# EAGLE design main_ver1.41 (EAGLE 7.2.0)
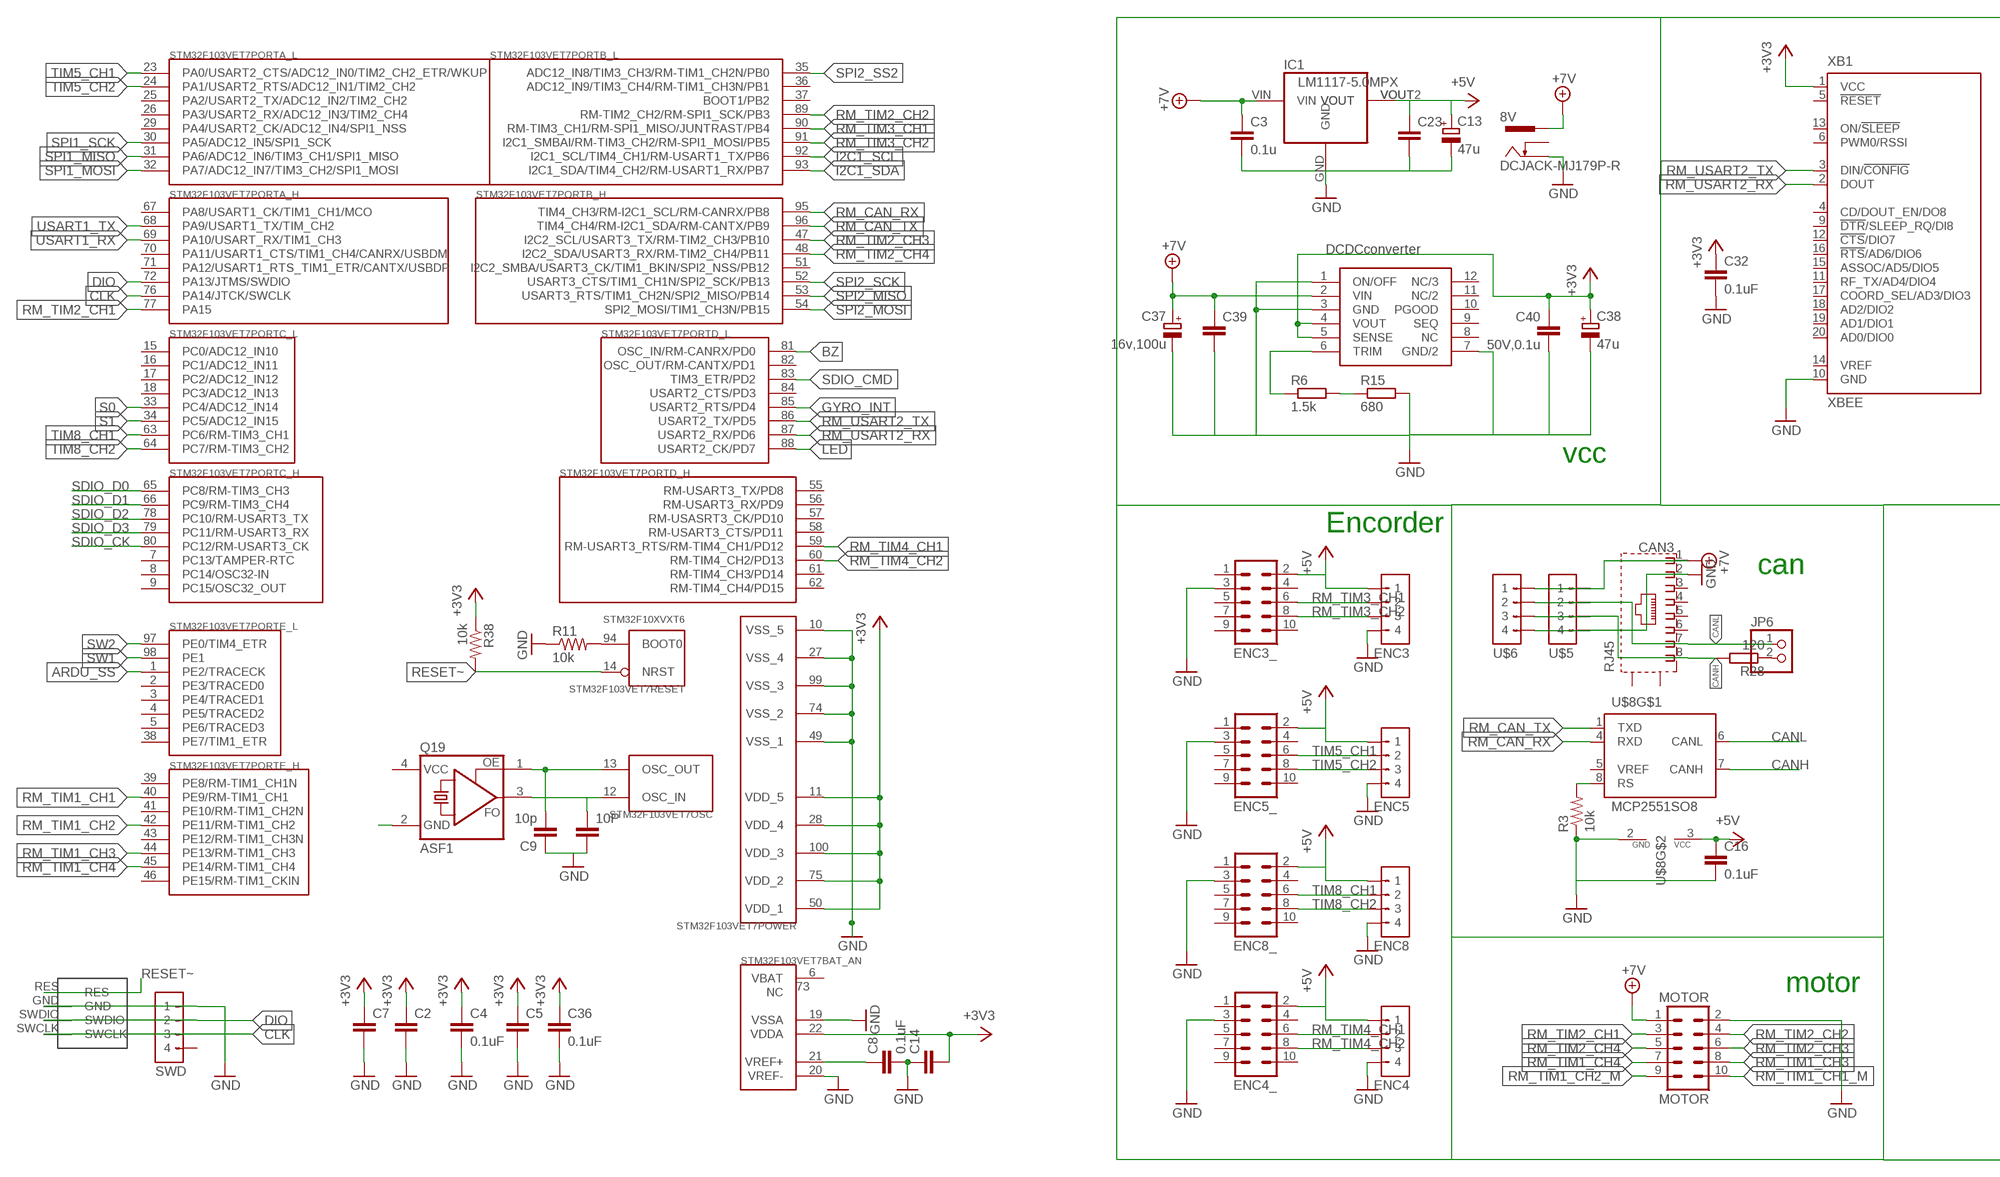
[diagram p0: schematic, sheet 1, part 1 of 2]
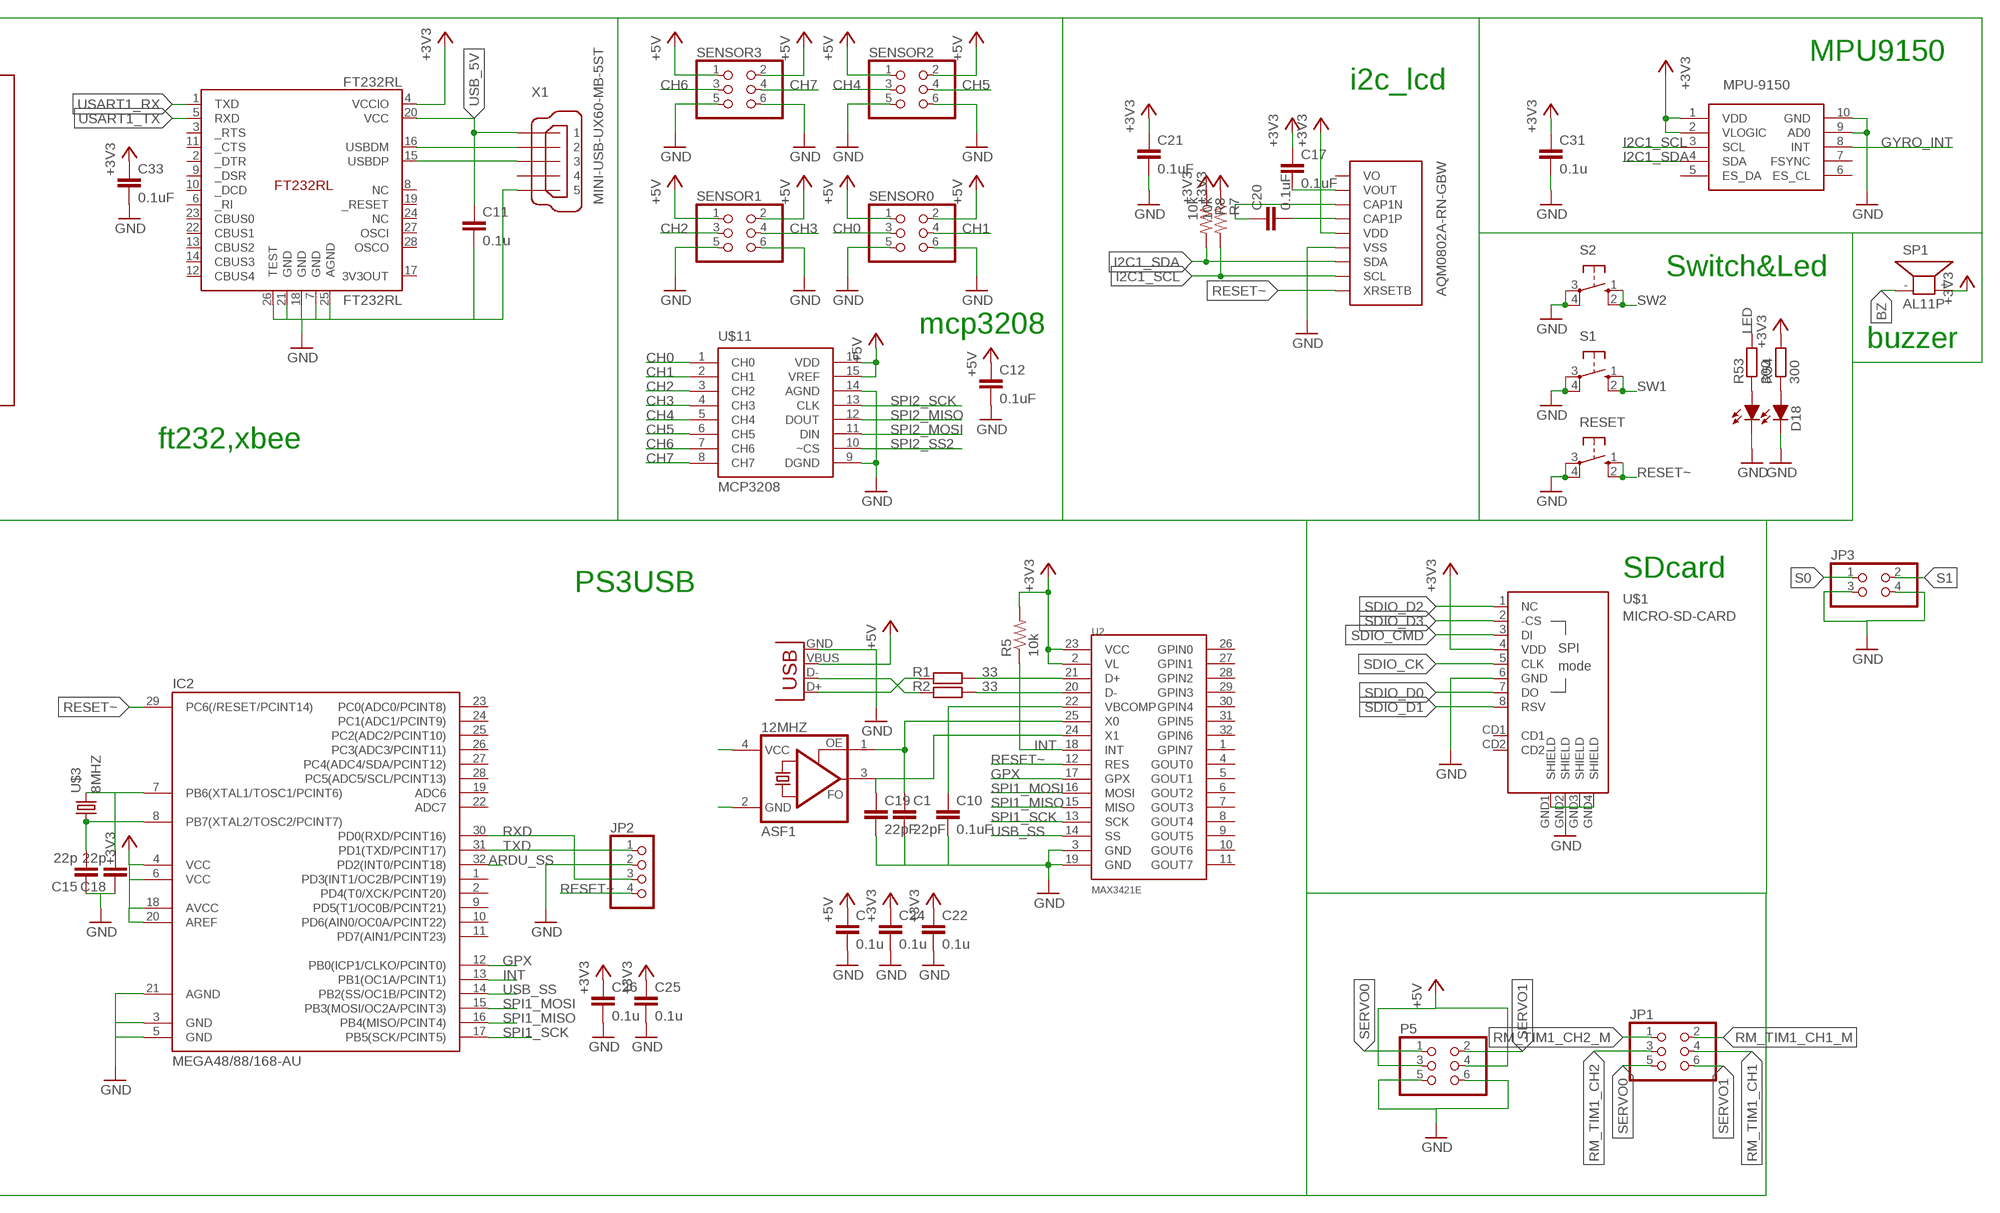
[diagram p1: schematic, sheet 1, part 2 of 2]

## Parts
8V  DCJACK-MJ179P-R  [MJ-179P-R]
10P  C-EUC0603  [C0603]
12MHZ  ASF1  [ASF]
AQM0802A-RN-GBW  AQM0802A-RN-GBW  [AQM0802]
C  0.1u  C-EUC0603  [C0603]
C1  22pF  C-EUC0603K  [C0603K]
C2  C-EUC0603  [C0603]
C3  0.1u  C-EUC0603K  [C0603K]
C4  0.1uF  C-EUC0603  [C0603]
C5  C-EUC0603  [C0603]
C7  C-EUC0603  [C0603]
C8  0.1uF  C-EUC0603  [C0603]
C9  10p  C-EUC0603  [C0603]
C10  0.1uF  C-EUC0603K  [C0603K]
C11  0.1u  C-EUC0603K  [C0603K]
C12  0.1uF  C-EUC0603  [C0603]
C13  47u  CPOL-EU153CLV-0405  [153CLV-0405]
C14  C-EUC0603  [C0603]
C15  22p  C-EUC0603K  [C0603K]
C16  0.1uF  C-EUC0603  [C0603]
C17  0.1uF  C-EUC0603  [C0603]
C18  22p  C-EUC0603K  [C0603K]
C19  22pF  C-EUC0603K  [C0603K]
C20  0.1uF  C-EUC0603  [C0603]
C21  0.1uF  C-EUC0603  [C0603]
C22  0.1u  C-EUC0603  [C0603]
C23  C-EUC0603K  [C0603K]
C24  0.1u  C-EUC0603  [C0603]
C25  0.1u  C-EUC0603  [C0603]
C26  0.1u  C-EUC0603  [C0603]
C31  0.1u  C-EUC0603K  [C0603K]
C32  0.1uF  C-EUC0603  [C0603]
C33  0.1uF  C-EUC0603  [C0603]
C36  0.1uF  C-EUC0603  [C0603]
C37  16v,100u  CPOL-EU153CLV-0605  [153CLV-0605]
C38  47u  CPOL-EU153CLV-0405  [153CLV-0405]
C39  C-EUC0603K  [C0603K]
C40  50V,0.1u  C-EUC0603K  [C0603K]
CAN3  RJ45  [LAN]
D18  SEC2XX4  [LED3025]
ENC3  CN4-JST-XH-TOP  [JST-B4B-XH-A]
ENC3_  ML10L  [ML10L]
ENC4  CN4-JST-XH-TOP  [JST-B4B-XH-A]
ENC4_  ML10L  [ML10L]
ENC5  CN4-JST-XH-TOP  [JST-B4B-XH-A]
ENC5_  ML10L  [ML10L]
ENC8  CN4-JST-XH-TOP  [JST-B4B-XH-A]
ENC8_  ML10L  [ML10L]
FT232RL  FT232RL  [SSOP-28]
IC1  LM1117-5.0MPX  LM1117-5.0IMP  [SOT223]
IC2  MEGA48/88/168-AU  [TQFP32-08]
JP1  PINHD-2X3  [2X03]
JP2  PINHD-1X4  [1X04]
JP3  PINHD-2X2/90  [2X02/90]
JP6  PINHD-1X2  [1X02]
MOTOR  MOTOR  ML10L  [ML10L]
MPU9150  MPU-9150  [MPU-9150]
P5  PINHD-2X3/90  [2X03/90]
Q19  ASF1  [ASF]
R1  33  R-EU_R0603  [R0603]
R2  33  R-EU_R0603  [R0603]
R3  10k  R-US_R0603  [R0603]
R5  10k  R-US_R0603  [R0603]
R6  1.5k  R-EU_R0603  [R0603]
R7  10k  R-US_R0603  [R0603]
R8  10k  R-US_R0603  [R0603]
R11  10k  R-US_R0603  [R0603]
R15  680  R-EU_R0603  [R0603]
R28  120  R-EU_R0603  [R0603]
R38  10k  R-US_R0603  [R0603]
R53  300  R-EU_R0603  [R0603]
R54  300  R-EU_R0603  [R0603]
RESET  10-XX  [B3F-10XX]
S1  10-XX  [B3F-10XX]
S2  10-XX  [B3F-10XX]
SENSOR0  PINHD-2X3/90  [2X03/90]
SENSOR1  PINHD-2X3/90  [2X03/90]
SENSOR2  PINHD-2X3/90  [2X03/90]
SENSOR3  PINHD-2X3/90  [2X03/90]
SP1  AL11P  [AL11P]
STM32F103VET7  STM32F10XVXT6  [LQFP100]
SWD  TOP_TYPE_4PIN  [TOP_TYPE_4PIN]
U2  MAX3421E  MAX3421ESMD  [TQFP32-5MM]
U$1  MICRO-SD-CARD  [DM3AT-SF-PEJ]
U$2  OKL-T/6-W12N  [OKL-T/6-W12]
U$3  8MHZ  [8MHZ_C]
U$5  S4B-XH-SM4-TB  [S4B-XH-SM4-TB]
U$6  S4B-XH-SM4-TB  [S4B-XH-SM4-TB]
U$7  STRINK  [STLINK]
U$8  MCP2551SO8  [SO08]
U$11  MCP3208  [SO16]
X1  MINI-USB-UX60-MB-5ST  [UX60-MB-5ST]
X2  USB_  [USB-A-S-SILK-FEMALE]
XB1  XBEE  [XBEE]

## Nets
+3V3 [VCC]: AQM0802A-RN-GBW.P$5(VDD) C2.1 C4.1 C5.1 C7.1 C14.2 C17.1 C21.1 C22.1 C24.1 C25.1 C26.1 C31.1 C32.1 C33.1 C36.1 C38.+ C40.1 FT232RL.4(VCCIO) IC2.4(VCC) IC2.6(VCC) IC2.18(AVCC) IC2.20(AREF) MPU9150.1(VDD) MPU9150.2(VLOGIC) R5.2 R7.1 R8.1 R38.1 R54.2 SP1.+ STM32F103VET7.11(POWER:VDD_5) STM32F103VET7.22(BAT_AN:VDDA) STM32F103VET7.28(POWER:VDD_4) STM32F103VET7.50(POWER:VDD_1) STM32F103VET7.75(POWER:VDD_2) STM32F103VET7.100(POWER:VDD_3) U2.2(VL) U2.23(VCC) U$1.4(VDD) U$2.4(VOUT) U$2.5(SENSE) XB1.1(VCC)
+5V [VCC]: C12.1 C13.+ C16.1 C23.1 C.1 ENC3.1 ENC3_.2 ENC4.1 ENC4_.2 ENC5.1 ENC5_.2 ENC8.1 ENC8_.2 IC1.VOUT IC1.VOUT2(VOUT) P5.3 P5.4 SENSOR0.1 SENSOR0.2 SENSOR1.1 SENSOR1.2 SENSOR2.1 SENSOR2.2 SENSOR3.1 SENSOR3.2 U$8.3(VCC) U$11.15(VREF) U$11.16(VDD) X2.VBUS
+7V [VCC]: 8V.1 C3.1 C37.+ C39.1 CAN3.1 IC1.VIN MOTOR.1 U$2.2(VIN) U$5.1 U$6.1
A [VCC]: 12MHZ.2(GND)
ARDU_SS: IC2.32(PD2(INT0/PCINT18)) STM32F103VET7.1(PORTE_L:PE2/TRACECK)
BZ: SP1.- STM32F103VET7.81(PORTD_L:OSC_IN/RM-CANRX/PD0)
CANH: CAN3.8 R28.2 U$5.3 U$6.3 U$8.7(CANH)
CANL: CAN3.7 JP6.1 U$5.2 U$6.2 U$8.6(CANL)
CH0: SENSOR0.3 U$11.1(CH0)
CH1: SENSOR0.4 U$11.2(CH1)
CH2: SENSOR1.3 U$11.3(CH2)
CH3: SENSOR1.4 U$11.4(CH3)
CH4: SENSOR2.3 U$11.5(CH4)
CH5: SENSOR2.4 U$11.6(CH5)
CH6: SENSOR3.3 U$11.7(CH6)
CH7: SENSOR3.4 U$11.8(CH7)
CLK: STM32F103VET7.76(PORTA_H:PA14/JTCK/SWCLK) SWD.3 U$7.SWCLK
D: 12MHZ.4(VCC)
DIO: STM32F103VET7.72(PORTA_H:PA13/JTMS/SWDIO) SWD.2 U$7.SWDIO
GND [GND]: 8V.2 10P.2 AQM0802A-RN-GBW.P$6(VSS) C1.2 C2.2 C3.2 C4.2 C5.2 C7.2 C8.2 C9.1 C10.2 C11.2 C12.2 C13.- C14.1 C15.1 C16.2 C18.1 C19.2 C21.2 C22.2 C23.2 C24.2 C25.2 C26.2 C31.2 C32.2 C33.2 C36.2 C37.- C38.- C39.2 C40.2 C.2 CAN3.2 D18.1(C0) D18.2(C1) ENC3.4 ENC3_.3 ENC4.4 ENC4_.3 ENC5.4 ENC5_.3 ENC8.4 ENC8_.3 FT232RL.7(GND) FT232RL.18(GND) FT232RL.21(GND) FT232RL.25(AGND) FT232RL.26(TEST) IC1.GND IC2.3(GND) IC2.5(GND) IC2.21(AGND) JP2.2 JP3.3 JP3.4 MOTOR.2 MPU9150.9(AD0) MPU9150.10(GND) P5.5 P5.6 R3.1 R11.1 R15.2 RESET.3(P) RESET.4(P1) S1.3(P) S1.4(P1) S2.3(P) S2.4(P1) SENSOR0.5 SENSOR0.6 SENSOR1.5 SENSOR1.6 SENSOR2.5 SENSOR2.6 SENSOR3.5 SENSOR3.6 STM32F103VET7.10(POWER:VSS_5) STM32F103VET7.19(BAT_AN:VSSA) STM32F103VET7.20(BAT_AN:VREF-) STM32F103VET7.27(POWER:VSS_4) STM32F103VET7.49(POWER:VSS_1) STM32F103VET7.74(POWER:VSS_2) STM32F103VET7.99(POWER:VSS_3) SWD.1 U2.3(GND) U2.19(GND) U$1.6(GND) U$1.GND1(SHIELD) U$1.GND2(SHIELD) U$1.GND3(SHIELD) U$1.GND4(SHIELD) U$2.1(ON/OFF) U$2.3(GND) U$2.7(GND/2) U$5.4 U$6.4 U$7.GND U$8.2(GND) U$11.9(DGND) U$11.14(AGND) X1.5 X2.GND XB1.10(GND)
GPX: IC2.12(PB0(ICP1/CLKO/PCINT0)) U2.17(GPX)
GYRO_INT: MPU9150.8(INT) STM32F103VET7.85(PORTD_L:USART2_RTS/PD4)
I2C1_SCL: AQM0802A-RN-GBW.P$8(SCL) MPU9150.3(SCL) R7.2 STM32F103VET7.92(PORTB_L:I2C1_SCL/TIM4_CH1/RM-USART1_TX/PB6)
I2C1_SDA: AQM0802A-RN-GBW.P$7(SDA) MPU9150.4(SDA) R8.2 STM32F103VET7.93(PORTB_L:I2C1_SDA/TIM4_CH2/RM-USART1_RX/PB7)
INT: IC2.13(PB1(OC1A/PCINT1)) R5.1 U2.18(INT)
LED: R53.2 STM32F103VET7.88(PORTD_L:USART2_CK/PD7)
N$4: C8.1 STM32F103VET7.21(BAT_AN:VREF+)
N$5: C9.2 Q19.1(OE) STM32F103VET7.13(OSC:OSC_OUT)
N$6: 10P.1 Q19.3(FO) STM32F103VET7.12(OSC:OSC_IN)
N$7: R11.2 STM32F103VET7.94(RESET:BOOT0)
N$9: R3.2 U$8.8(RS)
N$11: FT232RL.16(USBDM) X1.2
N$12: FT232RL.15(USBDP) X1.3
N$13: R1.2 X2.D+
N$14: JP6.2 R28.1
N$15: R2.2 X2.D-
N$16: R2.1 U2.20(D-)
N$17: R1.1 U2.21(D+)
N$18: 12MHZ.1(OE) C1.1 U2.25(X0)
N$19: 12MHZ.3(FO) C19.1 U2.24(X1)
N$20: C18.2 IC2.7(PB6(XTAL1/TOSC1/PCINT6)) U$3.P$2
N$21: C15.2 IC2.8(PB7(XTAL2/TOSC2/PCINT7)) U$3.P$1
N$22: AQM0802A-RN-GBW.P$4(CAP1P) C20.2
N$23: AQM0802A-RN-GBW.P$3(CAP1N) C20.1
N$24: AQM0802A-RN-GBW.P$2(VOUT) C17.2
N$26 [VCC]: Q19.2(GND)
N$31: R6.1 U$2.6(TRIM)
N$33: R6.2 R15.1
N$43: D18.3(A1) R53.1
N$58: D18.4(A0) R54.1
RESET~: AQM0802A-RN-GBW.P$9(XRSETB) IC2.29(PC6(/RESET/PCINT14)) JP2.4 R38.2 RESET.1(S) RESET.2(S1) STM32F103VET7.14(RESET:NRST) U2.12(RES) U$7.RES
RM_CAN_RX: STM32F103VET7.95(PORTB_H:TIM4_CH3/RM-I2C1_SCL/RM-CANRX/PB8) U$8.4(RXD)
RM_CAN_TX: STM32F103VET7.96(PORTB_H:TIM4_CH4/RM-I2C1_SDA/RM-CANTX/PB9) U$8.1(TXD)
RM_TIM1_CH1: JP1.4 STM32F103VET7.40(PORTE_H:PE9/RM-TIM1_CH1)
RM_TIM1_CH1_M: JP1.2 MOTOR.10
RM_TIM1_CH2: JP1.3 STM32F103VET7.42(PORTE_H:PE11/RM-TIM1_CH2)
RM_TIM1_CH2_M: JP1.1 MOTOR.9
RM_TIM1_CH3: MOTOR.8 STM32F103VET7.44(PORTE_H:PE13/RM-TIM1_CH3)
RM_TIM1_CH4: MOTOR.7 STM32F103VET7.45(PORTE_H:PE14/RM-TIM1_CH4)
RM_TIM2_CH1: MOTOR.3 STM32F103VET7.77(PORTA_H:PA15)
RM_TIM2_CH2: MOTOR.4 STM32F103VET7.89(PORTB_L:RM-TIM2_CH2/RM-SPI1_SCK/PB3)
RM_TIM2_CH3: MOTOR.6 STM32F103VET7.47(PORTB_H:I2C2_SCL/USART3_TX/RM-TIM2_CH3/PB10)
RM_TIM2_CH4: MOTOR.5 STM32F103VET7.48(PORTB_H:I2C2_SDA/USART3_RX/RM-TIM2_CH4/PB11)
RM_TIM3_CH1: ENC3.2 ENC3_.6 STM32F103VET7.90(PORTB_L:RM-TIM3_CH1/RM-SPI1_MISO/JUNTRAST/PB4)
RM_TIM3_CH2: ENC3.3 ENC3_.8 STM32F103VET7.91(PORTB_L:I2C1_SMBAI/RM-TIM3_CH2/RM-SPI1_MOSI/PB5)
RM_TIM4_CH1: ENC4.2 ENC4_.6 STM32F103VET7.59(PORTD_H:RM-USART3_RTS/RM-TIM4_CH1/PD12)
RM_TIM4_CH2: ENC4.3 ENC4_.8 STM32F103VET7.60(PORTD_H:RM-TIM4_CH2/PD13)
RM_USART2_RX: STM32F103VET7.87(PORTD_L:USART2_RX/PD6) XB1.2(DOUT)
RM_USART2_TX: STM32F103VET7.86(PORTD_L:USART2_TX/PD5) XB1.3(DIN/!CONFIG)
RXD: IC2.30(PD0(RXD/PCINT16)) JP2.3
S0: JP3.1 STM32F103VET7.33(PORTC_L:PC4/ADC12_IN14)
S1: JP3.2 STM32F103VET7.34(PORTC_L:PC5/ADC12_IN15)
SDIO_CK: STM32F103VET7.80(PORTC_H:PC12/RM-USART3_CK) U$1.5(CLK)
SDIO_CMD: STM32F103VET7.83(PORTD_L:TIM3_ETR/PD2) U$1.3(DI)
SDIO_D0: STM32F103VET7.65(PORTC_H:PC8/RM-TIM3_CH3) U$1.7(DO)
SDIO_D1: STM32F103VET7.66(PORTC_H:PC9/RM-TIM3_CH4) U$1.8(RSV)
SDIO_D2: STM32F103VET7.78(PORTC_H:PC10/RM-USART3_TX) U$1.1(NC)
SDIO_D3: STM32F103VET7.79(PORTC_H:PC11/RM-USART3_RX) U$1.2(-CS)
SERVO0: JP1.5 P5.1
SERVO1: JP1.6 P5.2
SPI1_MISO: IC2.16(PB4(MISO/PCINT4)) STM32F103VET7.31(PORTA_L:PA6/ADC12_IN6/TIM3_CH1/SPI1_MISO) U2.15(MISO)
SPI1_MOSI: IC2.15(PB3(MOSI/OC2A/PCINT3)) STM32F103VET7.32(PORTA_L:PA7/ADC12_IN7/TIM3_CH2/SPI1_MOSI) U2.16(MOSI)
SPI1_SCK: IC2.17(PB5(SCK/PCINT5)) STM32F103VET7.30(PORTA_L:PA5/ADC12_IN5/SPI1_SCK) U2.13(SCK)
SPI2_MISO: STM32F103VET7.53(PORTB_H:USART3_RTS/TIM1_CH2N/SPI2_MISO/PB14) U$11.12(DOUT)
SPI2_MOSI: STM32F103VET7.54(PORTB_H:SPI2_MOSI/TIM1_CH3N/PB15) U$11.11(DIN)
SPI2_SCK: STM32F103VET7.52(PORTB_H:USART3_CTS/TIM1_CH1N/SPI2_SCK/PB13) U$11.13(CLK)
SPI2_SS2: STM32F103VET7.35(PORTB_L:ADC12_IN8/TIM3_CH3/RM-TIM1_CH2N/PB0) U$11.10(~CS)
SW1: S1.1(S) S1.2(S1) STM32F103VET7.98(PORTE_L:PE1)
SW2: S2.1(S) S2.2(S1) STM32F103VET7.97(PORTE_L:PE0/TIM4_ETR)
TIM5_CH1: ENC5.2 ENC5_.6 STM32F103VET7.23(PORTA_L:PA0/USART2_CTS/ADC12_IN0/TIM2_CH2_ETR/WKUP)
TIM5_CH2: ENC5.3 ENC5_.8 STM32F103VET7.24(PORTA_L:PA1/USART2_RTS/ADC12_IN1/TIM2_CH2)
TIM8_CH1: ENC8.2 ENC8_.6 STM32F103VET7.63(PORTC_L:PC6/RM-TIM3_CH1)
TIM8_CH2: ENC8.3 ENC8_.8 STM32F103VET7.64(PORTC_L:PC7/RM-TIM3_CH2)
TXD: IC2.31(PD1(TXD/PCINT17)) JP2.1
USART1_RX: FT232RL.1(TXD) STM32F103VET7.69(PORTA_H:PA10/USART_RX/TIM1_CH3)
USART1_TX: FT232RL.5(RXD) STM32F103VET7.68(PORTA_H:PA9/USART1_TX/TIM_CH2)
USB_5V [VCC]: C11.1 FT232RL.20(VCC) X1.1
USB_SS: IC2.14(PB2(SS/OC1B/PCINT2)) U2.14(SS)
VBCOMP: C10.1 U2.22(VBCOMP)
Unconnected: 8V.3 AQM0802A-RN-GBW.P$1(VO) CAN3.3 CAN3.4 CAN3.5 CAN3.6 CAN3.P$11(S) CAN3.P$12(S) ENC3_.1 ENC3_.4 ENC3_.5 ENC3_.7 ENC3_.9 ENC3_.10 ENC4_.1 ENC4_.4 ENC4_.5 ENC4_.7 ENC4_.9 ENC4_.10 ENC5_.1 ENC5_.4 ENC5_.5 ENC5_.7 ENC5_.9 ENC5_.10 ENC8_.1 ENC8_.4 ENC8_.5 ENC8_.7 ENC8_.9 ENC8_.10 FT232RL.2(_DTR) FT232RL.3(_RTS) FT232RL.6(_RI) FT232RL.8(NC) FT232RL.9(_DSR) FT232RL.10(_DCD) FT232RL.11(_CTS) FT232RL.12(CBUS4) FT232RL.13(CBUS2) FT232RL.14(CBUS3) FT232RL.17(3V3OUT) FT232RL.19(_RESET) FT232RL.22(CBUS1) FT232RL.23(CBUS0) FT232RL.24(NC) FT232RL.27(OSCI) FT232RL.28(OSCO) IC2.1(PD3(INT1/OC2B/PCINT19)) IC2.2(PD4(T0/XCK/PCINT20)) IC2.9(PD5(T1/OC0B/PCINT21)) IC2.10(PD6(AIN0/OC0A/PCINT22)) IC2.11(PD7(AIN1/PCINT23)) IC2.19(ADC6) IC2.22(ADC7) IC2.23(PC0(ADC0/PCINT8)) IC2.24(PC1(ADC1/PCINT9)) IC2.25(PC2(ADC2/PCINT10)) IC2.26(PC3(ADC3/PCINT11)) IC2.27(PC4(ADC4/SDA/PCINT12)) IC2.28(PC5(ADC5/SCL/PCINT13)) MPU9150.5(ES_DA) MPU9150.6(ES_CL) MPU9150.7(FSYNC) STM32F103VET7.2(PORTE_L:PE3/TRACED0) STM32F103VET7.3(PORTE_L:PE4/TRACED1) STM32F103VET7.4(PORTE_L:PE5/TRACED2) STM32F103VET7.5(PORTE_L:PE6/TRACED3) STM32F103VET7.7(PORTC_H:PC13/TAMPER-RTC) STM32F103VET7.8(PORTC_H:PC14/OSC32-IN) STM32F103VET7.9(PORTC_H:PC15/OSC32_OUT) STM32F103VET7.15(PORTC_L:PC0/ADC12_IN10) STM32F103VET7.16(PORTC_L:PC1/ADC12_IN11) STM32F103VET7.17(PORTC_L:PC2/ADC12_IN12) STM32F103VET7.18(PORTC_L:PC3/ADC12_IN13) STM32F103VET7.25(PORTA_L:PA2/USART2_TX/ADC12_IN2/TIM2_CH2) STM32F103VET7.26(PORTA_L:PA3/USART2_RX/ADC12_IN3/TIM2_CH4) STM32F103VET7.29(PORTA_L:PA4/USART2_CK/ADC12_IN4/SPI1_NSS) STM32F103VET7.36(PORTB_L:ADC12_IN9/TIM3_CH4/RM-TIM1_CH3N/PB1) STM32F103VET7.37(PORTB_L:BOOT1/PB2) STM32F103VET7.38(PORTE_L:PE7/TIM1_ETR) STM32F103VET7.39(PORTE_H:PE8/RM-TIM1_CH1N) STM32F103VET7.41(PORTE_H:PE10/RM-TIM1_CH2N) STM32F103VET7.43(PORTE_H:PE12/RM-TIM1_CH3N) STM32F103VET7.46(PORTE_H:PE15/RM-TIM1_CKIN) STM32F103VET7.51(PORTB_H:I2C2_SMBA/USART3_CK/TIM1_BKIN/SPI2_NSS/PB12) STM32F103VET7.55(PORTD_H:RM-USART3_TX/PD8) STM32F103VET7.56(PORTD_H:RM-USART3_RX/PD9) STM32F103VET7.57(PORTD_H:RM-USASRT3_CK/PD10) STM32F103VET7.58(PORTD_H:RM-USART3_CTS/PD11) STM32F103VET7.61(PORTD_H:RM-TIM4_CH3/PD14) STM32F103VET7.62(PORTD_H:RM-TIM4_CH4/PD15) STM32F103VET7.67(PORTA_H:PA8/USART1_CK/TIM1_CH1/MCO) STM32F103VET7.70(PORTA_H:PA11/USART1_CTS/TIM1_CH4/CANRX/USBDM) STM32F103VET7.71(PORTA_H:PA12/USART1_RTS_TIM1_ETR/CANTX/USBDP) STM32F103VET7.73(BAT_AN:NC) STM32F103VET7.82(PORTD_L:OSC_OUT/RM-CANTX/PD1) STM32F103VET7.84(PORTD_L:USART2_CTS/PD3) SWD.4 U2.1(GPIN7) U2.4(GOUT0) U2.5(GOUT1) U2.6(GOUT2) U2.7(GOUT3) U2.8(GOUT4) U2.9(GOUT5) U2.10(GOUT6) U2.11(GOUT7) U2.26(GPIN0) U2.27(GPIN1) U2.28(GPIN2) U2.29(GPIN3) U2.30(GPIN4) U2.31(GPIN5) U2.32(GPIN6) U$1.CD1 U$1.CD2 U$2.8(NC) U$2.9(SEQ) U$2.10(PGOOD) U$2.11(NC/2) U$2.12(NC/3) U$8.5(VREF) X1.4 XB1.4(CD/DOUT_EN/DO8) XB1.5(!RESET) XB1.6(PWM0/RSSI) XB1.9(!DTR!/SLEEP_RQ/DI8) XB1.11(RF_TX/AD4/DIO4) XB1.12(!CTS!/DIO7) XB1.13(ON/!SLEEP) XB1.14(VREF) XB1.15(ASSOC/AD5/DIO5) XB1.16(!RTS!/AD6/DIO6) XB1.17(COORD_SEL/AD3/DIO3) XB1.18(AD2/DIO2) XB1.19(AD1/DIO1) XB1.20(AD0/DIO0)

## Notes on the sheet
- MPU9150
- i2c_lcd
- Switch&Led
- mcp3208
- buzzer
- ft232,xbee
- vcc
- Encorder
- SDcard
- can | PS3USB
- motor

## Power pins joined to a net without a drawn wire
VBAT: STM32F103VET7.6(BAT_AN:VBAT)
VCC: Q19.4(VCC)

## Library data of the parts
8V = akizuki-dcjack:DCJACK: DC JACK 2.1mmφ - 5.5mmφ DCジャック、基板用。
10P C9 = rcl:C-EU: CAPACITOR, European symbol
12MHZ Q19 = crystal:ASF*: CRYSTAL CLOCK OSCILLATORS 5.0 Vdc or 3.3 Vdc - LOW PROFILE ULTRA MINIATURE CERAMIC SURFACE MOUNT Source: http://www.abracon.com/Oscillators/asf1-L-L1.pdf
AQM0802A-RN-GBW = densikit:AQM0802A-RN-GBW
C C1-C5 C7 C8 C10-C12 C14-C26 C31-C33 C36 C39 C40 = resistor:C-EU: CAPACITOR, European symbol
C13 C37 C38 = rcl:CPOL-EU: POLARIZED CAPACITOR, European symbol
CAN3 = RJ45:RJ45
D18 = SRT162-010:SEC2XX4
ENC3-ENC5 ENC8 = con-jst_xh:CN4: Connector 4 circuits
ENC3_ ENC4_ ENC5_ ENC8_ = con-ml:ML10L: HARTING; OC_FARNELL: unknown; OC_NEWARK: unknown
FT232RL = ftdi:FT232RL
IC1 = Regulator:LM1117: 800mA and 1A Low Dropout (LDO) Positive Regulator 1.8V, 2.5V, 2.85V, 3.3V, 5V, and Adj
IC2 = avr-7:MEGA48/88/168
JP1 P5 SENSOR0 SENSOR1-SENSOR3 = pinhead:PINHD-2X3: PIN HEADER
JP2 = pinhead:PINHD-1X4: PIN HEADER
JP3 = pinhead:PINHD-2X2: PIN HEADER
JP6 = pinhead:PINHD-1X2: PIN HEADER
MOTOR = MIL-Conector:ML10L: HARTING
MPU9150 = MPU-9150:MPU-9150
R1 R2 R6 R15 R28 R53 R54 = resistor:R-EU_: RESISTOR, European symbol
R3 R5 R7 R8 R11 R38 = resistor:R-US_: RESISTOR, American symbol
RESET S1 S2 = switch-omron:10-XX: OMRON SWITCH; MPN: B3F-1000; OC_FARNELL: 176432; OC_NEWARK: 36M3542
SP1 = buzzer:AL11P: SPEAKER Source: Buerklin; OC_FARNELL: unknown; OC_NEWARK: unknown
STM32F103VET7 = stm32:STM32F10XVXT6: STM32F101/103 100 pin LQFP
SWD = GHconnector:TOP_TYPE_4PIN
U2 = SparkFun:MAX3421E: USB Peripheral/Host Controller w/ SPI
U$1 = micro_sd:MICRO-SD-CARD: HIROSE microSD socket DM3AT-SF-PEJ
U$2 = OKL-T_6-W12:OKL-T/6-W12N
U$3 = 8mhz:8MHZ
U$5 U$6 = S4B-XH-SM4-TB:S4B-XH-SM4-TB
U$7 = stlink:STRINK
U$8 = can:MCP2551: CAN Tranceiver Microchip
U$11 = mcp3208:MCP3208
X1 = con-hirose:MINI-USB-: MINI USB Connector Source: http://www.hirose.co.jp/cataloge_hp/e24000019.pdf; OC_FARNELL: unknown; OC_NEWARK: unknown
X2 = SparkFun:USB: USB Connectors USB-B-PTH is fully proven SKU : PRT-00139 USB-miniB is fully proven SKU : PRT-00587 USB-A-PCB is untested. USB-A-H is throughly reviewed, but untested. Spark Fun Electronics SKU : PRT-00437 USB-B-SMT is throughly reviewed, but untested. Needs silkscreen touching up. USB-A-S has not been used/tested USB-MB-H has not been used/tested
XB1 = microbuilder:XBEE: XBee (TM) /XBee-PRO(TM) OEM RF Modules Source: MaxStream, Inc. xbee_productmanual.pdf

## Board
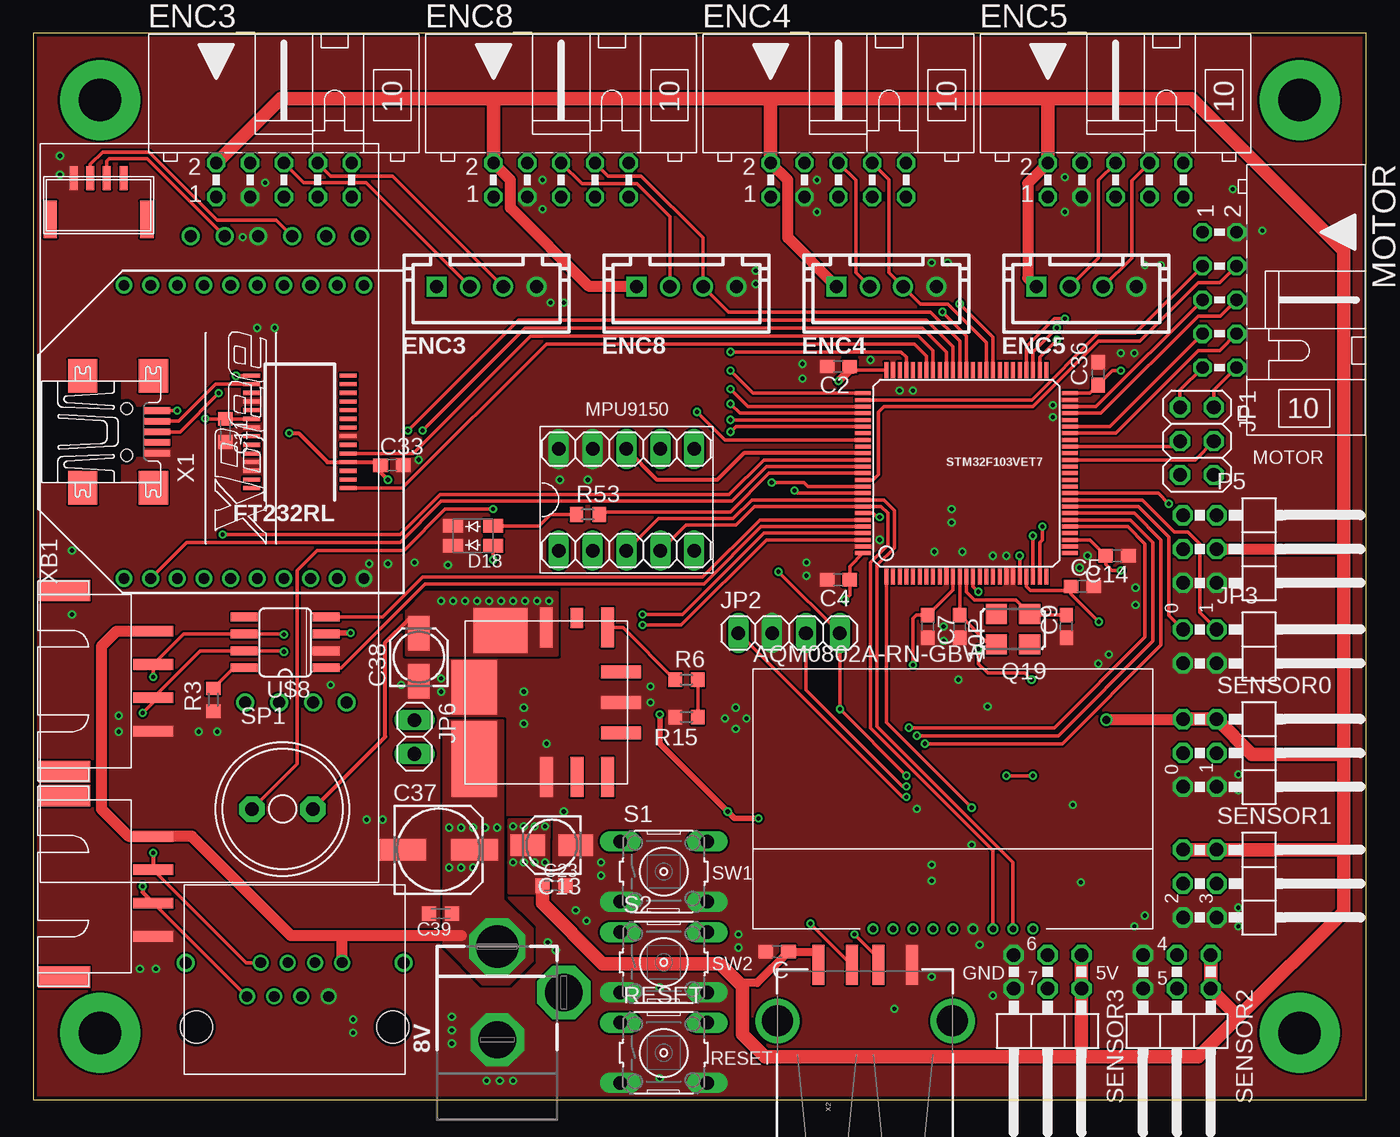
[diagram p2: board, top side]
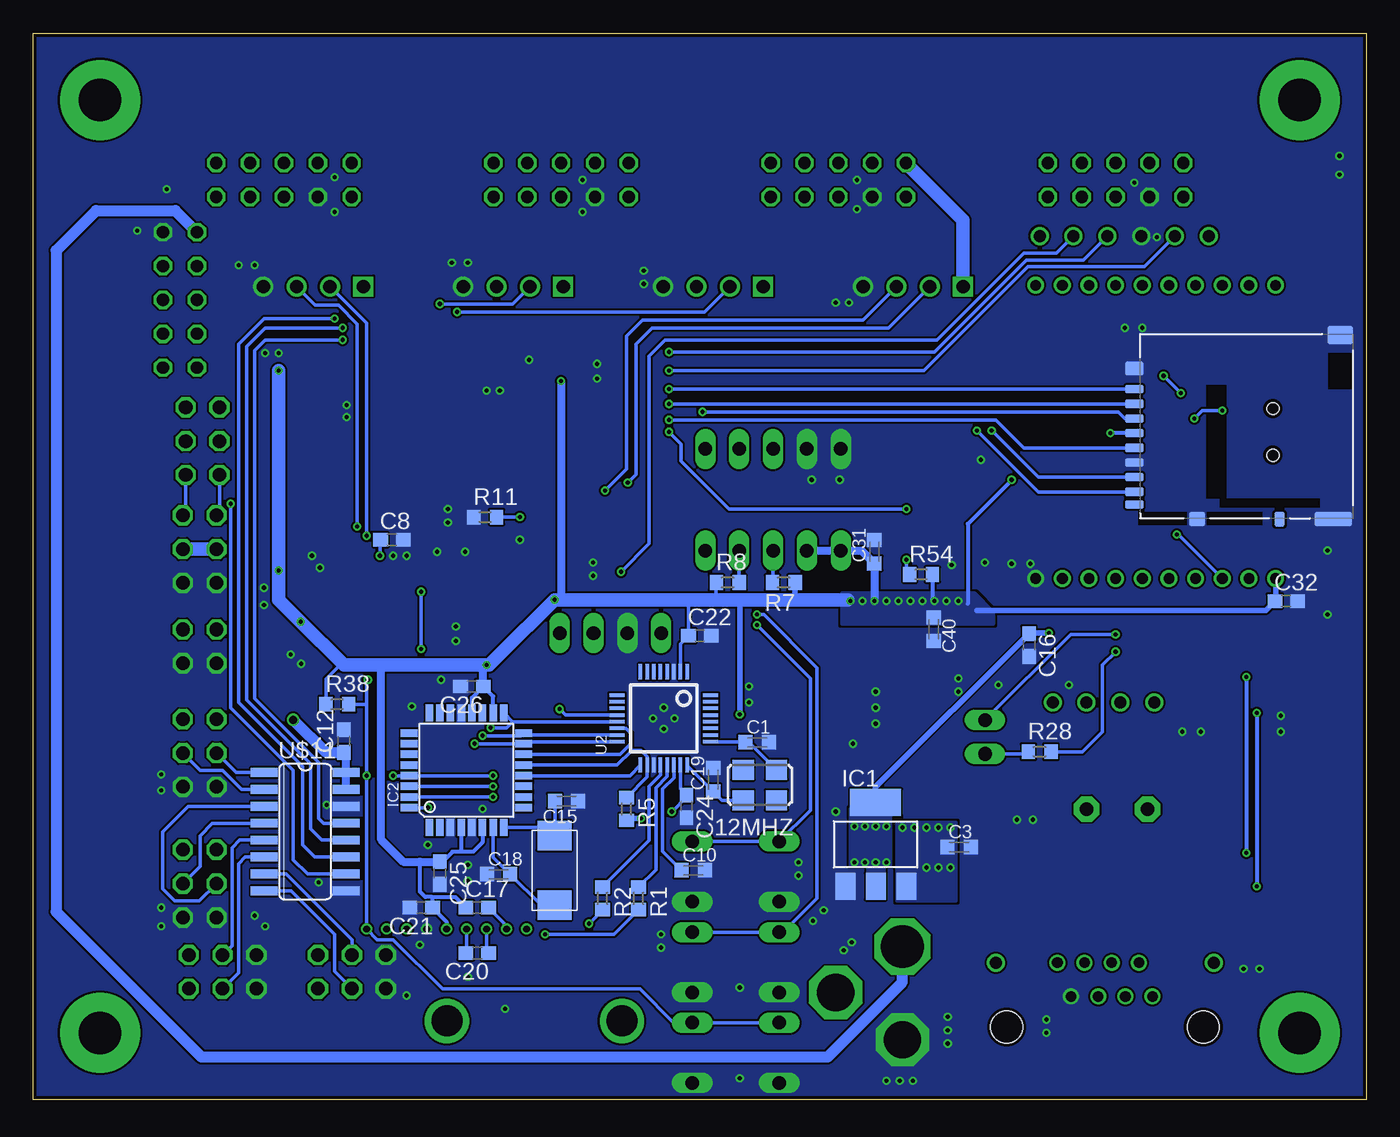
[diagram p3: board, bottom side, seen from below]

Size 100 x 80 mm. Coordinates in mm from the lower left corner, seen from the top.
Outline: 0,0 100,0 100,80 0,80 0,0
Copper layers (1*16): Top 0.035mm / dielectric 1.5mm / Bottom 0.035mm
Design rules "default *": minimum track width 6mil, minimum drill 12mil, track to track 6mil, track to pad 6mil, pad to pad 6mil, via to via 6mil, smd to smd 6mil, copper to edge 10mil, drill to drill 10mil, minimum pad ring 6mil, minimum via ring 6mil, stop-mask expansion 2mil, vias tented up to drill 25mil, thermal gap 10mil

### Footprints (pad centres in the part's own frame; a part is rotated, then mirrored left to right if it is on the bottom)
MJ-179P-R = drill 3.2 pad 4 octagon: 1 3,0 | drill 2.8 pad 4 octagon: 2 -4,0; 3 -0.45,-5
C0603 = smd 1.1 x 1: 1 -0.85,0; 2 0.85,0
ASF = smd 1.6 x 1.5: 1 -1.25,-1.15; 2 1.25,-1.15; 3 1.25,1.15; 4 -1.25,1.15
AQM0802 = drill 0.5: P$1 9,0; P$2 10.5,0; P$3 12,0; P$4 13.5,0; P$5 15,0; P$6 16.5,0; P$7 18,0; P$8 19.5,0; P$9 21,0
C0603K = smd 1.05 x 1.08: 1 -0.875,0; 2 0.875,0
153CLV-0405 = smd 2.6 x 1.6: + 1.8,0; - -1.8,0
153CLV-0605 = smd 3.5 x 1.6: + 2.7,0; - -2.7,0
LAN = drill 0.8: 1 3.57,1.27; 2 2.55,-1.27; 3 1.53,1.27; 4 0.51,-1.27; 5 -0.51,1.27; 6 -1.53,-1.27; 7 -2.55,1.27; 8 -3.57,-1.27 | drill 0.9: P$11 -8.175,1.27; P$12 8.175,1.27 | hole 2.4: -7.375,-3.57; 7.375,-3.57
LED3025 = smd 1.5 x 1: 1 1.5,0.75; 2 1.5,-0.75; 3 -1.5,-0.75; 4 -1.5,0.75
JST-B4B-XH-A = drill 1 square: 1 -3.75,0 | drill 1: 2 -1.25,0; 3 1.25,0; 4 3.75,0
ML10L = drill 0.914 octagon: 1 -5.08,-1.27; 2 -5.08,1.27; 3 -2.54,-1.27; 4 -2.54,1.27; 5 0,-1.27; 6 0,1.27; 7 2.54,-1.27; 8 2.54,1.27; 9 5.08,-1.27; 10 5.08,1.27
SSOP-28 = smd 0.305 x 1.27: 1 -4.225,-3.625; 2 -3.575,-3.625; 3 -2.925,-3.625; 4 -2.275,-3.625; 5 -1.625,-3.625; 6 -0.975,-3.625; 7 -0.325,-3.625; 8 0.325,-3.625; 9 0.975,-3.625; 10 1.625,-3.625; 11 2.275,-3.625; 12 2.925,-3.625; 13 3.575,-3.625; 14 4.225,-3.625; 15 4.225,3.625; 16 3.575,3.625; 17 2.925,3.625; 18 2.275,3.625; 19 1.625,3.625; 20 0.975,3.625; 21 0.325,3.625; 22 -0.325,3.625; 23 -0.975,3.625; 24 -1.625,3.625; 25 -2.275,3.625; 26 -2.925,3.625; 27 -3.575,3.625; 28 -4.225,3.625
SOT223 = smd 1.499 x 2.007: GND -2.261,-3.15; VIN 2.311,-3.15; VOUT 0.025,-3.15 | smd 3.81 x 2.007: VOUT2 0,3.15
TQFP32-08 = smd 1.27 x 0.559: 1 -4.293,2.8; 2 -4.293,2; 3 -4.293,1.2; 4 -4.293,0.4; 5 -4.293,-0.4; 6 -4.293,-1.2; 7 -4.293,-2; 8 -4.293,-2.8; 17 4.293,-2.8; 18 4.293,-2; 19 4.293,-1.2; 20 4.293,-0.4; 21 4.293,0.4; 22 4.293,1.2; 23 4.293,2; 24 4.293,2.8 | smd 0.559 x 1.27: 9 -2.8,-4.293; 10 -2,-4.293; 11 -1.2,-4.293; 12 -0.4,-4.293; 13 0.4,-4.293; 14 1.2,-4.293; 15 2,-4.293; 16 2.8,-4.293; 25 2.8,4.293; 26 2,4.293; 27 1.2,4.293; 28 0.4,4.293; 29 -0.4,4.293; 30 -1.2,4.293; 31 -2,4.293; 32 -2.8,4.293
2X03 = drill 1.016 octagon: 1 -2.54,-1.27; 2 -2.54,1.27; 3 0,-1.27; 4 0,1.27; 5 2.54,-1.27; 6 2.54,1.27
1X04 = drill 1.016 long: 1 -3.81,0; 2 -1.27,0; 3 1.27,0; 4 3.81,0
2X02/90 = drill 1.016 octagon: 1 -1.27,-6.35; 2 -1.27,-3.81; 3 1.27,-6.35; 4 1.27,-3.81
1X02 = drill 1.016 long: 1 -1.27,0; 2 1.27,0
MPU-9150 = drill 1.016 long: 1 -3.81,5.08; 2 -3.81,2.54; 3 -3.81,0; 4 -3.81,-2.54; 5 -3.81,-5.08; 6 3.81,-5.08; 7 3.81,-2.54; 8 3.81,0; 9 3.81,2.54; 10 3.81,5.08
2X03/90 = drill 1.016 octagon: 1 -2.54,-6.35; 2 -2.54,-3.81; 3 0,-6.35; 4 0,-3.81; 5 2.54,-6.35; 6 2.54,-3.81
R0603 = smd 1 x 1.1: 1 -0.85,0; 2 0.85,0
B3F-10XX = drill 1.016 long: 1 -3.251,2.261; 2 3.251,2.261; 3 -3.251,-2.261; 4 3.251,-2.261
AL11P = drill 1.016 pad 1.905 octagon: + 2.286,0; - -2.286,0
LQFP100 = smd 0.3 x 1.2: 1 -6,-7.75; 2 -5.5,-7.75; 3 -5,-7.75; 4 -4.5,-7.75; 5 -4,-7.75; 6 -3.5,-7.75; 7 -3,-7.75; 8 -2.5,-7.75; 9 -2,-7.75; 10 -1.5,-7.75; 11 -1,-7.75; 12 -0.5,-7.75; 13 0,-7.75; 14 0.5,-7.75; 15 1,-7.75; 16 1.5,-7.75; 17 2,-7.75; 18 2.5,-7.75; 19 3,-7.75; 20 3.5,-7.75; 21 4,-7.75; 22 4.5,-7.75; 23 5,-7.75; 24 5.5,-7.75; 25 6,-7.75; 51 6,7.75; 52 5.5,7.75; 53 5,7.75; 54 4.5,7.75; 55 4,7.75; 56 3.5,7.75; 57 3,7.75; 58 2.5,7.75; 59 2,7.75; 60 1.5,7.75; 61 1,7.75; 62 0.5,7.75; 63 0,7.75; 64 -0.5,7.75; 65 -1,7.75; 66 -1.5,7.75; 67 -2,7.75; 68 -2.5,7.75; 69 -3,7.75; 70 -3.5,7.75; 71 -4,7.75; 72 -4.5,7.75; 73 -5,7.75; 74 -5.5,7.75; 75 -6,7.75 | smd 1.2 x 0.3: 26 7.75,-6; 27 7.75,-5.5; 28 7.75,-5; 29 7.75,-4.5; 30 7.75,-4; 31 7.75,-3.5; 32 7.75,-3; 33 7.75,-2.5; 34 7.75,-2; 35 7.75,-1.5; 36 7.75,-1; 37 7.75,-0.5; 38 7.75,0; 39 7.75,0.5; 40 7.75,1; 41 7.75,1.5; 42 7.75,2; 43 7.75,2.5; 44 7.75,3; 45 7.75,3.5; 46 7.75,4; 47 7.75,4.5; 48 7.75,5; 49 7.75,5.5; 50 7.75,6; 76 -7.75,6; 77 -7.75,5.5; 78 -7.75,5; 79 -7.75,4.5; 80 -7.75,4; 81 -7.75,3.5; 82 -7.75,3; 83 -7.75,2.5; 84 -7.75,2; 85 -7.75,1.5; 86 -7.75,1; 87 -7.75,0.5; 88 -7.75,0; 89 -7.75,-0.5; 90 -7.75,-1; 91 -7.75,-1.5; 92 -7.75,-2; 93 -7.75,-2.5; 94 -7.75,-3; 95 -7.75,-3.5; 96 -7.75,-4; 97 -7.75,-4.5; 98 -7.75,-5; 99 -7.75,-5.5; 100 -7.75,-6
TOP_TYPE_4PIN = smd 0.6 x 1.8: 1 -1.875,2.025; 2 -0.625,2.025; 3 0.625,2.025; 4 1.875,2.025 | smd 1 x 2.8: P$1 -3.625,-1.075; P$2 3.625,-1.075
TQFP32-5MM = smd 1.143 x 0.254: 1 -3.5,1.75; 2 -3.5,1.25; 3 -3.5,0.75; 4 -3.5,0.25; 5 -3.5,-0.25; 6 -3.5,-0.75; 7 -3.5,-1.25; 8 -3.5,-1.75; 17 3.5,-1.75; 18 3.5,-1.25; 19 3.5,-0.75; 20 3.5,-0.25; 21 3.5,0.25; 22 3.5,0.75; 23 3.5,1.25; 24 3.5,1.75 | smd 0.254 x 1.143: 9 -1.75,-3.5; 10 -1.25,-3.5; 11 -0.75,-3.5; 12 -0.25,-3.5; 13 0.25,-3.5; 14 0.75,-3.5; 15 1.25,-3.5; 16 1.75,-3.5; 25 1.75,3.5; 26 1.25,3.5; 27 0.75,3.5; 28 0.25,3.5; 29 -0.25,3.5; 30 -0.75,3.5; 31 -1.25,3.5; 32 -1.75,3.5
DM3AT-SF-PEJ = smd 0.65 x 1.4: 1 3.2,16.4; 2 2.1,16.4; 3 1,16.4; 4 -0.1,16.4; 5 -1.2,16.4; 6 -2.3,16.4; 7 -3.4,16.4; 8 -4.5,16.4; CD1 -5.45,16.4 | smd 1.1 x 0.8: CD2 -6.55,5.5 | smd 1.1 x 2.8: GND1 -6.55,1.475 | smd 1.4 x 1.9: GND2 7.25,0.95 | smd 1 x 1.4: GND3 4.75,16.4 | smd 1.1 x 1.2: GND4 -6.55,11.7
OKL-T/6-W12 = smd 3 x 0.98: 1 -5.6,0; 9 -5.6,-4.58; 10 -5.6,-2.29 | smd 5.7 x 3.4: 2 -4.25,5.4 | smd 4.07 x 3.4: 3 1.145,5.4 | smd 3.4 x 4.07: 4 5.4,3.435 | smd 3 x 0.96: 5 5.62,0; 6 5.62,-4.58 | smd 0.96 x 3: 7 0,-5.6; 8 -2.29,-5.6; 12 2.29,-5.6 | smd 1.5 x 0.96: 11 6.35,-2.29
8MHZ_C = smd 2.2 x 2.54: P$1 -2.6,0; P$2 2.6,0
S4B-XH-SM4-TB = smd 0.8 x 3: 1 -3.75,7.4; 2 -1.25,7.4; 3 1.25,7.4; 4 3.75,7.4 | smd 1.6 x 3.9: P$1 -6.8,0.7; P$2 6.8,0.7
STLINK = drill 0.9: GND 16.38,48.5; P$1 15.4,13.5; P$2 23.02,13.5; P$3 17.94,13.5; P$4 20.48,13.5; P$5 11.3,48.5; P$10 24,48.5; RES 21.46,48.5; SWCLK 13.84,48.5; SWDIO 18.92,48.5
SO08 = smd 0.66 x 2.032: 1 -1.905,-3.073; 2 -0.635,-3.073; 3 0.635,-3.073; 4 1.905,-3.073; 5 1.905,3.073; 6 0.635,3.073; 7 -0.635,3.073; 8 -1.905,3.073
SO16 = smd 0.66 x 2.032: 1 -4.445,-3.073; 2 -3.175,-3.073; 3 -1.905,-3.073; 4 -0.635,-3.073; 5 0.635,-3.073; 6 1.905,-3.073; 7 3.175,-3.073; 8 4.445,-3.073; 9 4.445,3.073; 10 3.175,3.073; 11 1.905,3.073; 12 0.635,3.073; 13 -0.635,3.073; 14 -1.905,3.073; 15 -3.175,3.073; 16 -4.445,3.073
UX60-MB-5ST = smd 2 x 0.5: 1 2.25,1.6; 2 2.25,0.8; 3 2.25,0; 4 2.25,-0.8; 5 2.25,-1.6 | smd 2.2 x 2.5: M1 -3.3,-4.2; M2 -3.3,4.2; M3 2,4.2; M4 2,-4.2 | hole 0.9: 0,-1.75; 0,1.75
USB-A-S-SILK-FEMALE = smd 3 x 0.9: D+ 7.212,-1; D- 7.212,1; GND 7.212,-3.5; VBUS 7.212,3.5 | drill 2.311: P$5 3,-6.566; P$6 3,6.566
XBEE = drill 0.8 pad 1.27: 1 -11,9; 2 -11,7; 3 -11,5; 4 -11,3; 5 -11,1; 6 -11,-1; 7 -11,-3; 8 -11,-5; 9 -11,-7; 10 -11,-9; 11 11,-9; 12 11,-7; 13 11,-5; 14 11,-3; 15 11,-1; 16 11,1; 17 11,3; 18 11,5; 19 11,7; 20 11,9

### Placement (x,y rotation side)
8V  34.8,8.48 90 top
10P  69.5,35.5 270 top
12MHZ  45.5,23.6 180 bottom
AQM0802A-RN-GBW  54,12.8 0 top
C  55.8,11.1 180 top
C1  45.7,26.8 0 bottom
C2  60.4,55 180 top
C3  30.55,18.94 0 bottom
C4  60.4,39 180 top
C5  78.7,38.5 0 top
C7  67.1,35.5 270 top
C8  73.1,42 0 bottom
C9  77.5,35.5 90 top
C10  50.5,17.2 0 bottom
C11  14.4,50.2 270 top
C12  76.7,26.9 90 bottom
C13  38.9,19.1 180 top
C14  81.3,40.8 180 top
C15  60,22.4 180 bottom
C16  25.3,34.1 270 bottom
C17  66.7,14.4 0 bottom
C18  65.1,16.9 0 bottom
C19  49,24 90 bottom
C20  66.7,11 180 bottom
C21  70.9,14.4 180 bottom
C22  50,34.8 0 bottom
C23  39.07,16.04 0 top
C24  51,22 270 bottom
C25  69.5,17 270 bottom
C26  67.1,31 180 bottom
C31  36.9,41.1 90 bottom
C32  6,37.4 0 bottom
C33  26.9,47.6 0 top
C36  79.88,54.46 90 top
C37  30.4,18.74 0 top
C38  28.93,33.2 90 top
C39  30.55,13.96 180 top
C40  32.46,35.3 270 bottom
CAN3  19.6,9 0 top
D18  33,42.3 180 top
ENC3  34,61 0 top
ENC3_  18.8,69 0 top
ENC4  64,61 0 top
ENC4_  60.4,69 0 top
ENC5  79,61 0 top
ENC5_  81.2,69 0 top
ENC8  49,61 0 top
ENC8_  39.6,69 0 top
FT232RL  20,50.1 90 top
IC1  36.81,19.14 0 bottom
IC2  67.5,24.7 90 bottom
JP1  87.3,49.4 270 top
JP2  56.7,35 0 top
JP3  92.6,34 270 top
JP6  28.6,27.2 270 top
MOTOR  89,60 270 top
MPU9150  44.5,45 90 top
P5  92.6,41.3 270 top
Q19  73.5,35.3 180 top
R1  54.6,15.1 270 bottom
R2  57.3,15.1 270 bottom
R3  13.5,30 90 top
R5  55.5,21.8 270 bottom
R6  49,31.5 0 top
R7  43.7,38.8 180 bottom
R8  47.9,38.8 0 bottom
R11  66.1,43.7 0 bottom
R15  49,28.7 180 top
R28  24.5,26.1 0 bottom
R38  77.19,29.66 0 bottom
R53  41.6,43.9 0 top
R54  33.4,39.4 0 bottom
RESET  47.3,3.5 0 top
S1  47.3,17.1 0 top
S2  47.3,10.3 0 top
SENSOR0  92.6,26 270 top
SENSOR1  92.6,16.2 270 top
SENSOR2  85.8,4.5 180 top
SENSOR3  76.1,4.5 180 top
SP1  18.7,21.8 0 top
STM32F103VET7  70,47 0 top
SWD  4.89,67.11 0 top
U2  52.7,28.6 270 bottom
U$1  1,50.1 90 bottom
U$2  38.49,29.8 90 top
U$3  60.9,17.2 270 bottom
U$5  1.6,16 270 top
U$6  1.6,31.4 270 top
U$7  0.5,16.3 0 top
U$8  18.9,34.3 90 top
U$11  79.6,20.1 270 bottom
X1  7,50.1 0 top
X2  62.4,2.9 90 top
XB1  15.8,50.1 90 top

### Tracks (layer width: path | path; a pad name or v marks a point on that pad's centre or on a via)
+3V3  (via drill 0.3)
  Top 0.254: C2.1 61.5,54.75 STM32F103VET7.75 | STM32F103VET7.100 61.25,40 C4.1 61.25,37.85 v60.9,37.5 | v81.6,54.7 80.97,54.7 C36.1 79.27,53 STM32F103VET7.50 | STM32F103VET7.28 79.25,42 C14.2 80.45,40.15 80.9,39.7 v81.6,39.7 | STM32F103VET7.11 69,38.25 C7.1 66.25,36.35 66,36.1 v66,32.6 | STM32F103VET7.22 74.5,38.5 74.8,38.2 77.55,38.2 C5.1 77.85,37.95 v79.95,35.85
  Top 0.305: SP1.+ 26.4,27.21 26.4,34.3 28.1,36 29.2,36 | v26.6,46.5 26.05,47.05 C33.1 25.82,47.83 FT232RL.4 22.07,47.83 19.9,50 v19.2,50
  Top 0.406: v54.4,21.1 52.6,21.1 v52.1,21.6 47,26.7 v47,28.9
  Top 0.61: 61.5,54.75 61.25,54.75 v60.4,53.9
  Bottom 0.254: R8.1 48.8,38.75 48.8,37.5 | 59.75,37.45 59.8,37.5 | v60.9,37.5 59.9,37.5 | 67.7,14.4 C17.1 | v66,32.6 66.5,32.6 | R38.1 78.04,31.56 76.85,32.75 | U2.23 51.45,23.3 C24.1 51,22.7 v52.1,21.6 | 65.05,33.3 65.05,33.35 | U2.2 51.45,34.2 C22.1 50.85,37.35 51,37.5
  Bottom 0.305: IC2.20 67.1,30.15 C26.1 65.5,30.25 IC2.18 | 66.25,32.55 66.3,32.6 | IC2.6 66.3,19.3 67,18.6 67.9,18.6 | 67.9,18.6 68.55,18.6 69.3,17.85 C25.1 | IC2.4 67.9,18.6 | AQM0802A-RN-GBW.P$5 69,13.35 C21.1 70.05,15.15 70.1,15.2 | 70.1,15.2 68.35,15.2 C17.1 | 70.1,15.2 70.6,15.2 71,15.6 71,17.85 | R54.2 32.55,37.55 v32.4,37.4 | v26.6,46.5 29.9,43.2 29.9,37.2 | U$1.4 v19.2,50
  Bottom 0.406: R7.1 42.85,37.55 42.9,37.5 | v54.4,21.1 55.35,21.1 R5.2 | v47,28.9 47,37.4 47.1,37.5 | 59.9,37.5 59.8,37.5 | XB1.1 6.8,37.45 C32.1 7.55,36.7 29.2,36.7
  Bottom 0.61: MPU9150.2 MPU9150.1 37.87,41.19 C31.1 v36.9,37.4 | v60.4,53.9 60.4,37.5 | C26.1 66.25,32.55 | 74,32.6 73.9,32.5 73.9,19.5 72.25,17.85 71,17.85 C25.1
  Bottom 1.016: 59.9,37.5 60.4,37.5 v60.9,37.5 65.05,33.35 65.8,32.6 v66,32.6 66.3,32.6 66.5,32.6 74,32.6 76.7,32.6 76.85,32.75 v79.95,35.85 81.6,37.5 v81.6,39.7 v81.6,54.7 | 59.8,37.5 51,37.5 48.8,37.5 47.1,37.5 42.9,37.5 38.9,37.5
  other vias: 30.6,37.4 31.5,37.4 33.3,37.4 34.2,37.4 35.1,37.4 36,37.4 37.8,37.4 38.7,37.4
  pour Top (no thermals): 39.3,38 29.4,38 28,36.6 28,33.4 39.3,33.4
  pour Bottom (no thermals): 39.3,38 29.4,38 28,36.6 28,35.7 39.3,35.7
+5V  (via drill 0.3, 0.6 pad 0.3)
  Top 0.406: 58.9,10.8 X2.VBUS | U$8.3 22.04,35 v23.8,35
  Top 0.61: 52.95,8.75 54.3,8.75 C.1 58.6,11.1 58.9,10.8
  Top 0.813: ENC8.1 41.7,61 35.8,66.9 35.8,68.99 ENC8_.2 | ENC4.1 56.6,64.65 56.6,68.99 ENC4_.2 | ENC5_.2 74.6,68.75 74.6,61.65 ENC5.1 | SENSOR0.1 86.21,28.5 v80.5,28.5 | P5.4 98.3,41.3
  Top 1.016: C23.1 38.2,14.71 42.7,10.2 51.5,10.2 52.95,8.75 53.2,8.5 53.2,4.9 54.9,3.2 78.6,3.2 | 78.6,3.2 87.4,3.2 90.4,6.2 | 90.4,6.2 98.3,14.1 98.3,18.7 | 98.3,18.7 98.3,25.9 | 98.3,25.9 98.3,41.3 98.3,63.7 86.9,75.1 76,75.1 | 76,75.1 55.3,75.1 | 55.3,75.1 34.6,75.1 | 34.6,75.1 18.55,75.1 ENC3_.2 | SENSOR3.1 SENSOR3.2 78.64,3.24 78.6,3.2 | SENSOR2.1 SENSOR2.2 88.34,8.26 90.4,6.2 | SENSOR1.1 SENSOR1.2 98.26,18.74 98.3,18.7 | SENSOR0.1 SENSOR0.2 91.43,25.9 98.3,25.9 | ENC8_.2 34.52,75.02 34.6,75.1 | ENC4_.2 55.32,75.08 55.3,75.1 | ENC5_.2 76.12,74.98 76,75.1
  Bottom 0.406: v23.8,35 25.25,35 C16.1 36.81,23.44 36.81,22.79
  Bottom 0.61: U$11.15 U$11.16 76.53,25.88 C12.1 | 36.81,22.79 IC1.VOUT2
  Bottom 0.813: v80.5,28.5 78.05,26.05 C12.1
  Bottom 1.016: ENC3.1 30.25,66 ENC8_.2 | P5.3 P5.4
  other vias: 36,20.5 36.8,20.5 37.6,20.5 38.4,20.5 36,17.8 36.8,17.8 37.6,17.8 38.4,17.8
  pour Top (no thermals): 35.7,21 38.7,21 38.6,15.5 35.7,15.5
  pour Bottom (no thermals): 35.7,21.8 38.7,21.8 38.7,17.6 37.4,17.6 37.4,16.5 36.2,16.5 36.2,17.6 35.7,17.6
+7V  (via drill 0.3)
  Top 0.813: 32.1,12.3 23,12.3 | 23,12.3 19.34,12.3 11.89,19.75 U$5.1 7.15,19.75 5.1,21.8 5.1,34 6.25,35.15 U$6.1 | CAN3.1 23.17,12.13 23,12.3
  Bottom 0.813: 8V.1 34.8,8.8 40.4,3.2 87.4,3.2 98.3,14.1 98.3,63.7 95.3,66.7 89.35,66.7 MOTOR.1
  other vias: 31.2,20.4 32.1,20.4 33,20.4 33.9,20.4 34.8,20.4 31.2,17.4 32.1,17.4 33,17.4
  pour Top (no thermals): 30.8,28.4 35.2,28.4 35.2,15 37.4,12.8 37.4,10.4 35.7,8.7 33.7,8.7 30.8,11.6
  pour Bottom (no thermals): 30.8,20.8 35.2,20.8 35.2,14.9 30.8,14.9
ARDU_SS  (via drill 0.3)
  Top 0.254: STM32F103VET7.1 64,28.3 v70.4,21.9
  Bottom 0.254: v70.4,21.9 IC2.32
BZ  (via drill 0.3)
  Top 0.254: v34.5,44.3 30.9,44.3 27.8,41.2 21.3,41.2 19.8,39.7 19.8,25.19 SP1.- | STM32F103VET7.81 52.7,50.5 v52.3,50.1
  Bottom 0.254: v34.5,44.3 47.8,44.3 51.4,47.9 51.4,49.2 v52.3,50.1
CANH  (via drill 0.3)
  Top 0.254: U$5.3 CAN3.8 | v18.8,33.6 18.73,33.66 U$8.7 12.52,33.66 U$6.3 9,29.8 v8.2,29
  Top 0.305: v8.2,16 8.2,15.55 U$5.3
  Bottom 0.254: v18.8,33.6 19.8,32.6 19.8,27.6 21.3,26.1 R28.2
  Bottom 0.305: v8.2,29 v8.2,16
CANL  (via drill 0.3)
  Top 0.254: U$5.2 15.98,10.27 CAN3.7 | v18.8,34.9 18.77,34.94 U$8.6 11.29,34.94 U$6.2 v9,31.7
  Top 0.305: v9,18.5 U$5.2
  Bottom 0.254: v18.8,34.9 22.17,34.9 JP6.1
  Bottom 0.305: v9,31.7 v9,18.5
CH0
  Bottom 0.254: U$11.1 84.8,24.55 SENSOR0.3
CH1
  Bottom 0.254: U$11.2 84.38,23.27 85.8,24.7 87.49,24.7 SENSOR0.4
CH2
  Bottom 0.254: U$11.3 88.39,22 90.3,20.1 90.3,15.8 89.4,14.9 87.55,14.9 SENSOR1.3
CH3
  Bottom 0.254: U$11.4 86.56,20.73 87.5,19.8 87.5,17.49 SENSOR1.4
CH4
  Bottom 0.254: U$11.5 84.53,19.46 85.1,18.9 85.1,11.55 SENSOR2.3
CH5
  Bottom 0.254: U$11.6 84.11,18.2 84.6,17.7 84.6,9.51 SENSOR2.4
CH6
  Bottom 0.254: U$11.7 81.03,16.93 76.1,12 SENSOR3.3
CH7
  Bottom 0.254: U$11.8 80.66,15.65 77.4,12.4 77.4,9.61 SENSOR3.4
CLK  (via drill 0.3)
  Top 0.254: STM32F103VET7.76 54,53 v52.3,54.7 | SWD.3 5.51,70.42 5.7,70.6 8.54,70.6 U$7.SWCLK
  Bottom 0.254: v52.3,54.7 33.2,54.7 25.4,62.5 16.64,62.5 U$7.SWCLK
DIO  (via drill 0.3)
  Top 0.254: STM32F103VET7.72 65.5,55.7 65.1,56.1 v52.3,56.1 | SWD.2 4.26,70.17 5.2,71.1 8.7,71.1 13.8,66 18.22,66 U$7.SWDIO
  Bottom 0.254: v52.3,56.1 32.4,56.1 25.5,63 21.22,63 U$7.SWDIO
GND  (via drill 0.3)
  other vias: 57.7,55.2 57.7,54.1 62.8,55.5 9.2,9.8 8,9.8 24,6 24,5 31.4,6.2 31.4,5.2 31.4,4.2 34,1.4 35,1.4 36,1.4 38.6,11.8 39.2,11.2 25,21 26.2,21 42.6,17.8 42.6,16.8 39.8,21.6 47,8.4 47,1.6 22.3,31.1 27.6,31.1 30.6,30.6 30.6,31.6 36.8,30.6 36.8,29.4 36.8,28.2 6.4,28.8 6.4,27.6 12.4,27.6 13.8,27.6 25.2,40.2 26.6,40.2 31.1,40.1 28.6,40.3 15.7,64.7 17.4,68.8 2,70.8 2,69.4 38.8,59.8 39.8,59.8 38.2,69 38.2,66.8 54.2,62.2 54.2,61.2 58.8,69 58.8,66.6 67.4,62.8 68.6,62.8 77.4,69.2 77.4,66.6 83.4,62.6 84.6,62.6 90,68.3 92.2,65.2 82.6,56 81.6,56 90.4,24.4 90.4,23.2 90.4,14.4 90.4,13 83.4,13.8 82.6,13 72,7.8 71,11.6 78,22.1 67.4,9.2 64.6,6.8 67.4,17.6 67.4,16.4 70.4,19.1 66.3,21.8 69.4,31.5 71.6,29.5 52.9,12.4 52.9,11.4 68.3,35.5 68.3,34.4 79.9,32.7 80.7,33.4 79.1,40.8 78.5,39.9 82.7,38.4 82.7,37.1 16.8,57.9 18.1,57.9 39.5,46.5 41.6,46.5 46.3,31 46.3,29.8 52.7,29.4 51.9,28.6 52.7,27.8 53.5,28.6 40.7,14.2 41.5,13.4 38.5,26.7 2.9,36.4 2.9,41.2 65,53.2 66,53.2 76.5,52.1 76.5,51.2 63.5,42 58,40.3 58,39.3 68.9,44.3 68.9,43.3 69.7,41.1 67.6,41.1 73,40.8 72,40.8 78.6,16.3 28.9,48
  pour Top (rank 6, no thermals): -3.9,84.8 106.9,84.8 106.9,-3.3 -3.9,-3.3
  pour Bottom (rank 6, no thermals): -4.6,85.4 108.4,85.4 108.4,-5.8 -4.6,-5.8
GPX
  Bottom 0.254: U2.17 55.25,24.3 IC2.12
GYRO_INT
  Top 0.305: STM32F103VET7.85 53.3,48.5 51.3,46.5 46.81,46.5 MPU9150.8
I2C1_SCL
  Top 0.254: MPU9150.3 46.91,43.6 52.5,43.6 53.9,45 STM32F103VET7.92 63.8,45 64.6,44.2 64.6,41.4 63.3,40.1 63.3,28 73.5,17.8 AQM0802A-RN-GBW.P$8
  Bottom 0.254: R7.2 44.5,38.85 MPU9150.3
I2C1_SDA
  Top 0.254: MPU9150.4 48.95,43.1 52.7,43.1 54.1,44.5 STM32F103VET7.93 63.6,44.5 64.1,44 64.1,41.6 62.8,40.3 62.8,27.9 72,18.7 AQM0802A-RN-GBW.P$7
  Bottom 0.254: R8.2 MPU9150.4
INT
  Bottom 0.254: IC2.13 56.2,25.1 55.1,26.2 54.4,26.2 53.95,25.75 U2.18 53.95,24.2 R5.1
LED
  Top 0.254: STM32F103VET7.88 55.2,47 52.3,44.1 42.65,44.1 R53.2
N$1  (via drill 3.2 pad 6)
  other vias: 5,5
N$2  (via drill 3.2 pad 6)
  other vias: 95,5
N$3  (via drill 3.2 pad 6)
  other vias: 95,75
N$4  (via drill 0.3)
  Top 0.254: STM32F103VET7.21 v74,40.8
  Bottom 0.254: v74,40.8 74,41.95 C8.1
N$5
  Top 0.254: STM32F103VET7.13 70,38.1 70.6,37.5 73.7,37.5 Q19.1 74.85,36.35 C9.2
N$6
  Top 0.254: STM32F103VET7.12 10P.1 71.7,34.15 Q19.3
N$7  (via drill 0.3)
  Top 0.254: STM32F103VET7.94 63,44 63.3,43.7 v63.5,43.7
  Bottom 0.254: v63.5,43.7 R11.2
N$8  (via drill 3.2 pad 6)
  other vias: 5,75
N$9
  Top 0.254: U$8.8 15.04,32.4 R3.2
N$11
  Top 0.254: FT232RL.16 13.68,53.67 10.9,50.9 X1.2
N$12  (via drill 0.3)
  Top 0.254: X1.3 11,50.1 v13.9,53 | v15.2,54.3 15.22,54.33 FT232RL.15
  Bottom 0.254: v13.9,53 v15.2,54.3
N$13  (via drill 0.3)
  Top 0.254: v61.6,12.4 63.4,10.6 X2.D+
  Bottom 0.254: R1.2 56.45,12.4 v61.6,12.4
N$14
  Bottom 0.254: R28.1 25.52,25.93 JP6.2
N$15  (via drill 0.3)
  Top 0.254: v58.3,13.2 61.39,10.11 X2.D-
  Bottom 0.254: R2.2 57.3,14.2 v58.3,13.2
N$16
  Bottom 0.254: R2.1 53.8,19.45 53.8,23.5 52.95,24.35 U2.20
N$17
  Bottom 0.254: R1.1 53.3,17.25 53.3,23.4 52.45,24.25 U2.21
N$18
  Bottom 0.254: U2.25 46.62,26.85 C1.1 46.3,26.8 12MHZ.1
N$19
  Bottom 0.254: U2.24 50.95,25.07 C19.1 48.33,22.45 12MHZ.3
N$20
  Bottom 0.254: IC2.7 65.5,18.18 C18.2 61.92,14.6 U$3.P$2
N$21
  Bottom 0.254: C15.2 60.88,20.3 | 60.88,20.3 60.88,19.82 U$3.P$1 | IC2.8 60.98,20.41 60.88,20.3
N$22
  Bottom 0.254: AQM0802A-RN-GBW.P$4 67.5,11.05 C20.2
N$23
  Bottom 0.254: AQM0802A-RN-GBW.P$3 66,11.15 C20.1
N$24
  Bottom 0.254: C17.2 64.5,13.05 AQM0802A-RN-GBW.P$2
N$31
  Top 0.254: R6.1 44.23,35.42 U$2.6
N$33
  Top 0.254: R15.1 R6.2
N$43
  Top 0.254: R53.1 38.8,43.9 37.95,43.05 D18.3
N$58  (via drill 0.3)
  Top 0.254: v34.5,40.5 D18.4
  Bottom 0.254: R54.1 34.5,39.65 v34.5,40.5
RESET~  (via drill 0.3)
  Top 0.254: STM32F103VET7.14 70.5,38.5 v70.9,38.1 | v70.9,33.8 70.9,32.7 71.6,32 74.4,32 v74.9,31.5 | v65.5,24.3 v60.51,29.29 JP2.4 v55.91,39.6 | v73,24.3 v75,24.3
  Bottom 0.254: v70.9,38.1 v70.9,33.8 | v74.9,31.5 75,31.4 75,29.7 | 75,29.7 v75,24.3 AQM0802A-RN-GBW.P$9 74.2,12 73,12 69.3,8.3 54.5,8.3 51.96,5.76 RESET.2 RESET.1 | R38.2 75.04,29.66 75,29.7 | v65.5,24.3 IC2.29 v73,24.3 | U2.12 60.07,28.85 v60.51,29.29 | U$7.RES 23.26,63.5 25.7,63.5 32.2,57 52.6,57 53.8,55.8 53.8,41.71 v55.91,39.6
RM_CAN_RX
  Top 0.254: STM32F103VET7.95 54.5,43.5 50.2,39.2 29.2,39.2 26.2,36.2 U$8.4
RM_CAN_TX
  Top 0.254: STM32F103VET7.96 54.6,43 50.3,38.7 29.4,38.7 23.09,32.4 U$8.1
RM_TIM1_CH1
  Top 0.254: STM32F103VET7.40 87.17,48 JP1.4
RM_TIM1_CH1_M
  Top 0.254: JP1.2 88.57,53.22 MOTOR.10
RM_TIM1_CH2
  Top 0.254: STM32F103VET7.42 85.63,49 JP1.3
RM_TIM1_CH2_M
  Top 0.254: JP1.1 86.03,53.22 MOTOR.9
RM_TIM1_CH3
  Top 0.254: STM32F103VET7.44 81.2,50 87.4,56.2 89.01,56.2 MOTOR.8
RM_TIM1_CH4
  Top 0.254: STM32F103VET7.45 80.77,50.5 MOTOR.7
RM_TIM2_CH1
  Top 0.254: STM32F103VET7.77 74.9,52.5 79.9,57.5 82.69,57.5 MOTOR.3
RM_TIM2_CH2
  Top 0.254: MOTOR.4 89.03,61.3 87.4,61.3 83,56.9 79.9,56.9 75,52 63.8,52 63.4,51.6 63.4,46.9 63,46.5 STM32F103VET7.89
RM_TIM2_CH3
  Top 0.254: STM32F103VET7.47 80.1,51.5 87.4,58.8 89.07,58.8 MOTOR.6
RM_TIM2_CH4
  Top 0.254: STM32F103VET7.48 79.73,52 MOTOR.5
RM_TIM3_CH1  (via drill 0.3)
  Top 0.254: ENC3_.6 20.27,68.8 24.95,68.8 ENC3.2 | STM32F103VET7.90 58.1,46 57.8,46.3 v55.4,46.3
  Bottom 0.254: v55.4,46.3 54.8,46.9 54.8,56.7 53.6,57.9 35.85,57.9 ENC3.2
RM_TIM3_CH2  (via drill 0.3)
  Top 0.254: ENC3.3 26.95,69.3 22.31,69.3 ENC3_.8 | STM32F103VET7.91 57.3,45.5 v57.1,45.7
  Bottom 0.254: ENC3.3 37.75,58.5 54.3,58.5 55.5,57.3 55.5,47.3 v57.1,45.7
RM_TIM4_CH1  (via drill 0.3)
  Top 0.254: ENC4_.6 61.7,68.97 61.7,62.05 ENC4.2 | STM32F103VET7.59 72,57.2 v69.5,59.7
  Bottom 0.254: v69.5,59.7 64.05,59.7 ENC4.2
RM_TIM4_CH2
  Top 0.254: ENC4_.8 64.2,69.01 64.2,62.05 ENC4.3 66.55,59.7 68.6,59.7 71.5,56.8 STM32F103VET7.60
RM_USART2_RX
  Top 0.254: STM32F103VET7.87 55,47.5 52.4,44.9 30.6,44.9 27.5,41.8 11.5,41.8 XB1.2
RM_USART2_TX  (via drill 0.3)
  Top 0.254: STM32F103VET7.86 54.8,48 52.2,45.4 30.5,45.4 27.5,42.4 v14.2,42.4
  Bottom 0.254: v14.2,42.4 14.1,42.4 XB1.3
RXD  (via drill 0.3)
  Top 0.254: JP2.3 57.97,30.73 65.2,23.5 v65.5,23.5
  Bottom 0.254: IC2.30 v65.5,23.5
S0
  Top 0.254: STM32F103VET7.33 82.9,44.5 85.2,42.2 85.2,36.32 JP3.1
S1
  Top 0.254: STM32F103VET7.34 83.2,45 85.6,42.6 86.6,42.6 87.5,41.7 87.5,36.56 JP3.2
SDIO_CK  (via drill 0.3)
  Top 0.254: v52.3,51 STM32F103VET7.80
  Bottom 0.254: v52.3,51 27.8,51 25.7,48.9 U$1.5
SDIO_CMD  (via drill 0.3)
  Top 0.254: STM32F103VET7.83 51.9,49.5 v49.8,51.6
  Bottom 0.254: U$1.3 18.1,51.1 18.6,51.6 v49.8,51.6
SDIO_D0  (via drill 0.3)
  Top 0.254: STM32F103VET7.65 69,56.5 67,58.5 36.4,58.5 v28.1,50.2
  Bottom 0.254: v28.1,50.2 24.6,46.7 U$1.7
SDIO_D1  (via drill 0.3)
  Top 0.254: STM32F103VET7.66 68.5,56.1 66.7,57.9 36.9,57.9 v29.2,50.2
  Bottom 0.254: v29.2,50.2 24.6,45.6 U$1.8
SDIO_D2  (via drill 0.3)
  Top 0.254: STM32F103VET7.78 53.6,52 v52.3,53.3
  Bottom 0.254: U$1.1 v52.3,53.3
SDIO_D3  (via drill 0.3)
  Top 0.254: STM32F103VET7.79 53,51.5 v52.3,52.2
  Bottom 0.254: U$1.2 v52.3,52.2
SERVO0
  Bottom 0.254: JP1.5 86.03,44.06 P5.1
SERVO1
  Bottom 0.254: JP1.6 88.57,44.06 P5.2
SPI1_MISO  (via drill 0.3)
  Top 0.254: v66.3,27.3 76.9,27.3 84,34.4 84,41.8 82.3,43.5 STM32F103VET7.31
  Bottom 0.254: U2.15 63.06,27.35 IC2.16 63.41,27.3 v66.3,27.3
SPI1_MOSI  (via drill 0.3)
  Top 0.254: v66.9,26.7 77.2,26.7 84.6,34.1 84.6,42 82.6,44 STM32F103VET7.32
  Bottom 0.254: U2.16 63.06,26.85 IC2.15 v66.9,26.7
SPI1_SCK  (via drill 0.3)
  Top 0.254: STM32F103VET7.30 82.1,43 83.4,41.7 83.4,34.7 76.6,27.9 v65.7,27.9
  Bottom 0.254: U2.13 64.06,28.35 | v65.7,27.9 64.51,27.9 64.06,28.35 | IC2.17 64.06,28.35
SPI2_MISO  (via drill 0.3)
  Top 0.254: STM32F103VET7.53 75,56.1 v76.8,57.9
  Bottom 0.254: v76.8,57.9 82.6,57.9 84,56.5 84,30 79.2,25.2 79.2,20.3 78.36,19.46 U$11.12
SPI2_MOSI  (via drill 0.3)
  Top 0.254: STM32F103VET7.54 74.5,56.5 76.6,58.6 v77.4,58.6
  Bottom 0.254: v77.4,58.6 82.7,58.6 84.6,56.7 84.6,29.8 79.8,25 79.8,19.1 78.89,18.2 U$11.11
SPI2_SCK  (via drill 0.3)
  Top 0.254: STM32F103VET7.52 75.5,55.7 v76.8,57
  Bottom 0.254: v76.8,57 82.6,57 83.4,56.2 83.4,30.1 78.6,25.3 78.6,21.1 78.23,20.73 U$11.13
SPI2_SS2  (via drill 0.3)
  Top 0.254: v85.2,44.7 84.4,45.5 STM32F103VET7.35
  Bottom 0.254: U$11.10 79.42,16.93 80.5,18 80.5,24.7 85.2,29.4 v85.2,44.7
SW1  (via drill 0.3)
  Top 0.254: STM32F103VET7.98 55,42 48.6,35.6 v45.7,35.6
  Bottom 0.254: S1.2 S1.1 41.7,21.71 41.7,31.6 v45.7,35.6
SW2  (via drill 0.3)
  Top 0.254: STM32F103VET7.97 54.8,42.5 48.7,36.4 v45.7,36.4
  Bottom 0.254: S2.2 S2.1 43.74,12.56 41.2,15.1 41.2,32.4 45.2,36.4 v45.7,36.4
TIM5_CH1  (via drill 0.3)
  Top 0.254: STM32F103VET7.23 v75,42.3 | ENC5_.6 79.9,68.97 79.9,63.15 ENC5.2
  Bottom 0.254: v75,42.3 75,58.25 ENC5.2
TIM5_CH2  (via drill 0.3)
  Top 0.254: ENC5_.8 82.4,68.93 82.4,63.15 ENC5.3 | STM32F103VET7.24 75.5,41.8 75.7,42 v75.7,43
  Bottom 0.254: ENC5.3 78.85,59.6 77.1,59.6 75.7,58.2 v75.7,43
TIM8_CH1  (via drill 0.3)
  Top 0.254: STM32F103VET7.63 70,57.3 v68.2,59.1 | ENC8_.6 41.17,68.7 45.3,68.7 47.75,66.25 ENC8.2
  Bottom 0.254: v68.2,59.1 49.65,59.1 ENC8.2
TIM8_CH2
  Top 0.254: STM32F103VET7.64 69.5,56.9 67.3,59.1 52.15,59.1 ENC8.3 50.25,64.65 45.6,69.3 43.11,69.3 ENC8_.8
TXD  (via drill 0.3)
  Top 0.254: v65.5,22.7 65.19,22.7 JP2.1
  Bottom 0.254: IC2.31 v65.5,22.7
USART1_RX
  Top 0.254: STM32F103VET7.69 67,55.8 66.1,56.7 38.5,56.7 27.68,45.88 FT232RL.1
USART1_TX
  Top 0.254: STM32F103VET7.68 67.5,56.2 66.4,57.3 37.3,57.3 28.48,48.48 FT232RL.5
USB_5V  (via drill 0.3)
  Top 0.254: X1.1 v10.8,51.7 | v12.9,51.1 12.93,51.08 C11.1 FT232RL.20
  Bottom 0.254: v10.8,51.7 12.3,51.7 v12.9,51.1
USB_SS
  Bottom 0.254: IC2.14 56,25.9 55.2,26.7 55.2,27.5 55.55,27.85 U2.14
VBCOMP
  Bottom 0.254: U2.22 51.95,24.15 52.8,23.3 52.8,18.62 C10.1

### Text on the board
tPlace: MPU9150 | MOTOR | 0 | 1 | 0 | 1 | SW1 | 2 | 3 | 6 | 4 | SW2 | GND | 7 | 5V | 5 | RESET